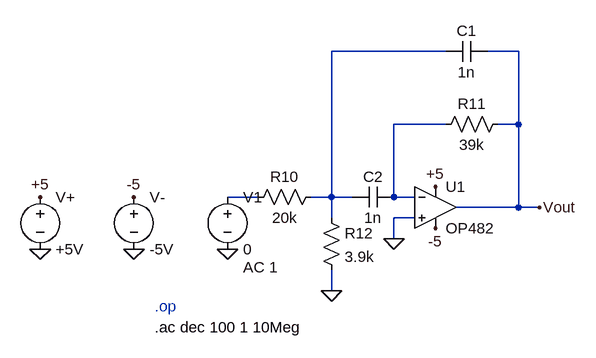
[diagram p0: schematic Etaj2OP_AC.asc]
Etaj2OP_AC.asc, the LTspice schematic file:
Version 4.1
SHEET 1 880 680
WIRE 240 -16 64 -16
WIRE 352 -16 304 -16
WIRE 240 96 160 96
WIRE 352 96 352 -16
WIRE 352 96 320 96
WIRE -48 208 -96 208
WIRE 64 208 64 -16
WIRE 64 208 32 208
WIRE 96 208 64 208
WIRE 160 208 160 96
WIRE 192 208 160 208
WIRE 352 224 352 96
WIRE 352 224 256 224
WIRE 384 224 352 224
WIRE 64 240 64 208
WIRE 192 240 160 240
WIRE 160 272 160 240
WIRE 64 352 64 320
FLAG 160 272 0
FLAG 64 352 0
FLAG 384 224 Vout
FLAG 224 192 +5
FLAG 224 256 -5
FLAG -384 288 0
FLAG -240 288 0
FLAG -384 208 +5
FLAG -240 208 -5
FLAG -96 288 0
SYMBOL OpAmps\\OP482 224 160 R0
SYMATTR InstName U1
SYMBOL cap 160 192 R90
WINDOW 0 0 32 VBottom 2
WINDOW 3 32 32 VTop 2
SYMATTR InstName C2
SYMATTR Value 1n
SYMBOL res 48 224 R0
SYMATTR InstName R12
SYMATTR Value 3.9k
SYMBOL res 48 192 R90
WINDOW 0 0 56 VBottom 2
WINDOW 3 32 56 VTop 2
SYMATTR InstName R10
SYMATTR Value 20k
SYMBOL res 336 80 R90
WINDOW 0 0 56 VBottom 2
WINDOW 3 32 56 VTop 2
SYMATTR InstName R11
SYMATTR Value 39k
SYMBOL cap 304 -32 R90
WINDOW 0 0 32 VBottom 2
WINDOW 3 32 32 VTop 2
SYMATTR InstName C1
SYMATTR Value 1n
SYMBOL voltage -384 192 R0
SYMATTR InstName V+
SYMATTR Value +5V
SYMBOL voltage -240 192 R0
SYMATTR InstName V-
SYMATTR Value -5V
SYMBOL voltage -96 192 R0
WINDOW 123 24 124 Left 2
WINDOW 39 0 0 Left 0
SYMATTR Value2 AC 1
SYMATTR InstName V1
SYMATTR Value 0
TEXT -208 376 Left 2 ;.op
TEXT -208 408 Left 2 !.ac dec 100 1 10Meg

The netlist it stands for:
* Etaj2OP_AC.asc
X§U1 0 N002 +5 -5 Vout OP482  ; pins In+ In- V+ V- OUT
C2 N002 N001 1n
R12 N001 0 3.9k
R10 N001 N003 20k
R11 Vout N002 39k
C1 Vout N001 1n
V+ +5 0 +5V
V- -5 0 -5V
V1 N003 0 0 AC 1
* .op
.ac dec 100 1 10Meg
.backanno
.end